# Altium schematic sheet LED_NEON.SchDoc
size A
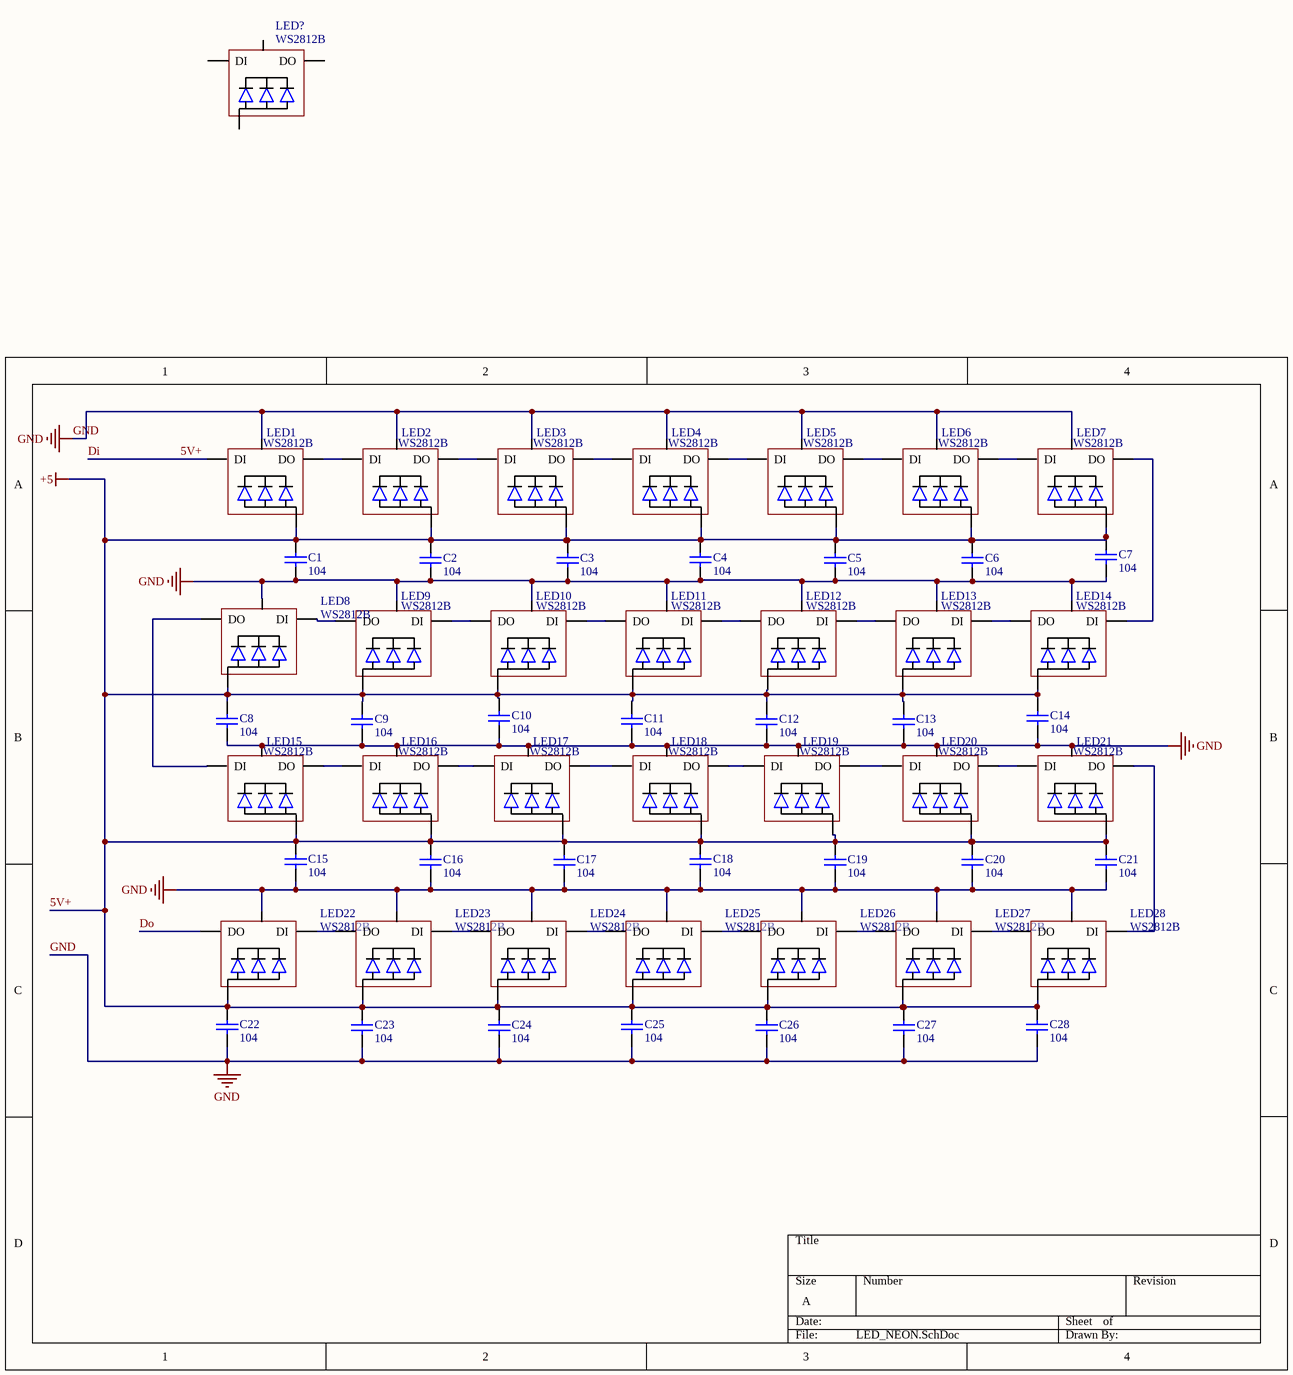
[diagram p0: LED_NEON.SchDoc]

## Parts
C1  104  [tu 0805]
C2  104  [tu 0805]
C3  104  [tu 0805]
C4  104  [tu 0805]
C5  104  [tu 0805]
C6  104  [tu 0805]
C7  104  [tu 0805]
C8  104  [tu 0805]
C9  104  [tu 0805]
C10  104  [tu 0805]
C11  104  [tu 0805]
C12  104  [tu 0805]
C13  104  [tu 0805]
C14  104  [tu 0805]
C15  104  [tu 0805]
C16  104  [tu 0805]
C17  104  [tu 0805]
C18  104  [tu 0805]
C19  104  [tu 0805]
C20  104  [tu 0805]
C21  104  [tu 0805]
C22  104  [tu 0805]
C23  104  [tu 0805]
C24  104  [tu 0805]
C25  104  [tu 0805]
C26  104  [tu 0805]
C27  104  [tu 0805]
C28  104  [tu 0805]
LED1  WS2812B  [LED]
LED2  WS2812B  [LED]
LED3  WS2812B  [LED]
LED4  WS2812B  [LED]
LED5  WS2812B  [LED]
LED6  WS2812B  [LED]
LED7  WS2812B  [LED]
LED8  WS2812B  [LED]
LED9  WS2812B  [LED]
LED10  WS2812B  [LED]
LED11  WS2812B  [LED]
LED12  WS2812B  [LED]
LED13  WS2812B  [LED]
LED14  WS2812B  [LED]
LED15  WS2812B  [LED]
LED16  WS2812B  [LED]
LED17  WS2812B  [LED]
LED18  WS2812B  [LED]
LED19  WS2812B  [LED]
LED20  WS2812B  [LED]
LED21  WS2812B  [LED]
LED22  WS2812B  [LED]
LED23  WS2812B  [LED]
LED24  WS2812B  [LED]
LED25  WS2812B  [LED]
LED26  WS2812B  [LED]
LED27  WS2812B  [LED]
LED28  WS2812B  [LED]
LED?  WS2812B

## Nets
5V+: C1.1 C2.1 C3.1 C4.1 C5.1 C6.1 C7.1 C8.1 C9.1 C10.1 C11.1 C12.1 C13.1 C14.1 C15.1 C16.1 C17.1 C18.1 C19.1 C20.1 C21.1 C22.1 C23.1 C24.1 C25.1 C26.1 C27.1 C28.1 LED1.1(VDD) LED1.4(DI) LED2.1(VDD) LED3.1(VDD) LED4.1(VDD) LED5.1(VDD) LED6.1(VDD) LED7.1(VDD) LED8.1(VDD) LED9.1(VDD) LED10.1(VDD) LED11.1(VDD) LED12.1(VDD) LED13.1(VDD) LED14.1(VDD) LED15.1(VDD) LED16.1(VDD) LED17.1(VDD) LED18.1(VDD) LED19.1(VDD) LED20.1(VDD) LED21.1(VDD) LED22.1(VDD) LED23.1(VDD) LED24.1(VDD) LED25.1(VDD) LED26.1(VDD) LED27.1(VDD) LED28.1(VDD)  [also labelled +5, Di]
GND: C1.2 C2.2 C3.2 C4.2 C5.2 C6.2 C7.2 C8.2 C9.2 C10.2 C11.2 C12.2 C13.2 C14.2 C15.2 C16.2 C17.2 C18.2 C19.2 C20.2 C21.2 C22.2 C23.2 C24.2 C25.2 C26.2 C27.2 C28.2 LED1.3(GND) LED2.3(GND) LED3.3(GND) LED4.3(GND) LED5.3(GND) LED6.3(GND) LED7.3(GND) LED8.3(GND) LED9.3(GND) LED10.3(GND) LED11.3(GND) LED12.3(GND) LED13.3(GND) LED14.3(GND) LED15.3(GND) LED16.3(GND) LED17.3(GND) LED18.3(GND) LED19.3(GND) LED20.3(GND) LED21.3(GND) LED22.3(GND) LED23.3(GND) LED24.3(GND) LED25.3(GND) LED26.3(GND) LED27.3(GND) LED28.3(GND)
Do: LED22.2(DO)
NetLED1_2: LED1.2(DO) LED2.4(DI)
NetLED2_2: LED2.2(DO) LED3.4(DI)
NetLED3_2: LED3.2(DO) LED4.4(DI)
NetLED4_2: LED4.2(DO) LED5.4(DI)
NetLED5_2: LED5.2(DO) LED6.4(DI)
NetLED6_2: LED6.2(DO) LED7.4(DI)
NetLED7_2: LED7.2(DO) LED14.4(DI)
NetLED8_2: LED8.2(DO) LED15.4(DI)
NetLED8_4: LED8.4(DI) LED9.2(DO)
NetLED9_4: LED9.4(DI) LED10.2(DO)
NetLED10_4: LED10.4(DI) LED11.2(DO)
NetLED11_4: LED11.4(DI) LED12.2(DO)
NetLED12_4: LED12.4(DI) LED13.2(DO)
NetLED13_4: LED13.4(DI) LED14.2(DO)
NetLED15_2: LED15.2(DO) LED16.4(DI)
NetLED16_2: LED16.2(DO) LED17.4(DI)
NetLED17_2: LED17.2(DO) LED18.4(DI)
NetLED18_2: LED18.2(DO) LED19.4(DI)
NetLED19_2: LED19.2(DO) LED20.4(DI)
NetLED20_2: LED20.2(DO) LED21.4(DI)
NetLED21_2: LED21.2(DO) LED28.4(DI)
NetLED22_4: LED22.4(DI) LED23.2(DO)
NetLED23_4: LED23.4(DI) LED24.2(DO)
NetLED24_4: LED24.4(DI) LED25.2(DO)
NetLED25_4: LED25.4(DI) LED26.2(DO)
NetLED26_4: LED26.4(DI) LED27.2(DO)
NetLED27_4: LED27.4(DI) LED28.2(DO)

Not connected (* = marked no-connect by the designer): LED? 2(DO) 3(GND) 4(DI)

## Library data of the parts
C1-C28 = Tu 0805 104 50V 10%: Dán; Don_Vi: Con; So_Chan: 2; Ten_Linh_Kien: Tụ 0805 104-100nF 10% 50V; Ma_Hang: MH004551; Chung_Loai: Dán; Kieu_Chan: *